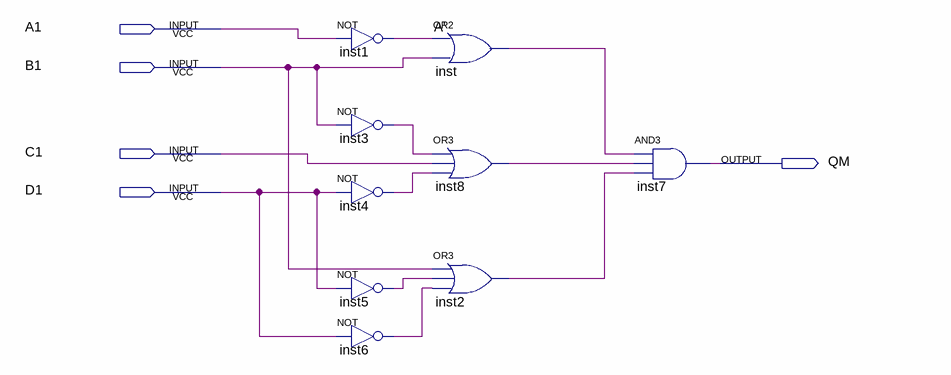
[diagram p0: schematic sheet]
// Quartus schematic Lab01POS.bdf as structural Verilog: 9 symbols, 5 pins
module Lab01POS (
  input  A1,
  input  B1,
  input  C1,
  input  D1,
  output QM
);

  wire \A' , inst2_out, inst3_out, inst4_out, inst5_out, inst6_out, inst8_out, inst_out;

  not inst1 (\A' , A1);
  not inst3 (inst3_out, B1);
  not inst4 (inst4_out, D1);
  not inst5 (inst5_out, D1);
  not inst6 (inst6_out, D1);
  or inst (inst_out, \A' , B1);
  or inst8 (inst8_out, inst3_out, C1, inst4_out);
  or inst2 (inst2_out, B1, inst5_out, inst6_out);
  and inst7 (QM, inst_out, inst8_out, inst2_out);
endmodule
